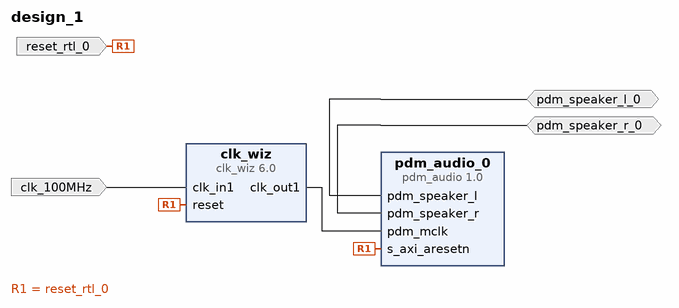
[diagram p0: block diagram of the top level]
# Vivado block design design_1, xc7s50csga324-1, Vivado 2022.2
create_bd_design design_1

create_bd_port -dir I -type clk clk_100MHz
set_property -dict {CONFIG.FREQ_HZ 100000000} [get_bd_ports clk_100MHz]
create_bd_port -dir I -type rst reset_rtl_0
set_property -dict {CONFIG.POLARITY ACTIVE_HIGH} [get_bd_ports reset_rtl_0]
create_bd_port -dir IO pdm_speaker_l_0
create_bd_port -dir IO pdm_speaker_r_0

create_bd_cell -type ip -vlnv realdigital.org:realdigital:pdm_audio:1.0 pdm_audio_0
set_property -dict {CONFIG.pcmResetCyclesParam 100000000} [get_bd_cells pdm_audio_0]
create_bd_cell -type ip -vlnv xilinx.com:ip:clk_wiz:6.0 clk_wiz

# ---- connections ----

connect_bd_net [get_bd_ports pdm_speaker_l_0] [get_bd_pins pdm_audio_0/pdm_speaker_l]
connect_bd_net [get_bd_ports pdm_speaker_r_0] [get_bd_pins pdm_audio_0/pdm_speaker_r]
connect_bd_net [get_bd_ports clk_100MHz] [get_bd_pins clk_wiz/clk_in1]
connect_bd_net [get_bd_pins clk_wiz/clk_out1] [get_bd_pins pdm_audio_0/pdm_mclk]
connect_bd_net -net reset_rtl_0_1 [get_bd_ports reset_rtl_0] [get_bd_pins clk_wiz/reset] [get_bd_pins pdm_audio_0/s_axi_aresetn]

validate_bd_design
save_bd_design
